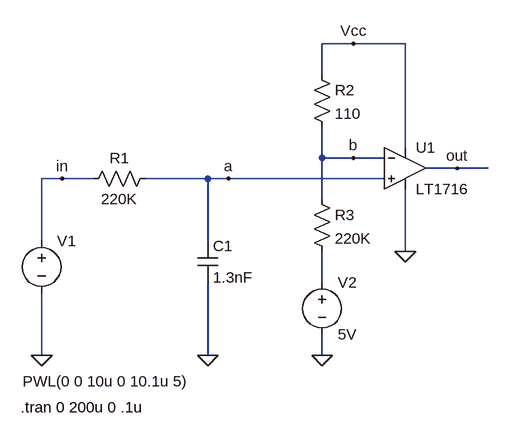
[diagram p0: schematic problem-2.asc]
problem-2.asc, the LTspice schematic file:
Version 4
SHEET 1 1128 680
WIRE 496 -288 448 -288
WIRE 576 -288 496 -288
WIRE 448 -240 448 -288
WIRE 576 -128 576 -288
WIRE 448 -112 448 -160
WIRE 496 -112 448 -112
WIRE 544 -112 496 -112
WIRE 656 -96 608 -96
WIRE 704 -96 656 -96
WIRE 48 -80 16 -80
WIRE 96 -80 48 -80
WIRE 272 -80 176 -80
WIRE 304 -80 272 -80
WIRE 544 -80 304 -80
WIRE 448 -48 448 -112
WIRE 16 16 16 -80
WIRE 272 16 272 -80
WIRE 576 32 576 -64
WIRE 448 80 448 32
WIRE 16 192 16 96
WIRE 272 192 272 80
WIRE 448 192 448 160
FLAG 272 192 0
FLAG 16 192 0
FLAG 576 32 0
FLAG 448 192 0
FLAG 48 -80 in
FLAG 304 -80 a
FLAG 496 -112 b
FLAG 496 -288 Vcc
FLAG 656 -96 out
SYMBOL cap 256 16 R0
SYMATTR InstName C1
SYMATTR Value 1.3nF
SYMBOL voltage 16 0 R0
WINDOW 3 -29 232 Left 2
WINDOW 123 0 0 Left 0
WINDOW 39 0 0 Left 0
SYMATTR Value PWL(0 0 10u 0 10.1u 5)
SYMATTR InstName V1
SYMBOL res 192 -96 R90
WINDOW 0 0 56 VBottom 2
WINDOW 3 32 56 VTop 2
SYMATTR InstName R1
SYMATTR Value 220K
SYMATTR SpiceLine tol=5
SYMBOL res 432 -64 R0
SYMATTR InstName R3
SYMATTR Value 220K
SYMBOL res 432 -256 R0
SYMATTR InstName R2
SYMATTR Value 110
SYMBOL Comparators\\LT1716 576 -96 R0
SYMATTR InstName U1
SYMBOL voltage 448 64 R0
WINDOW 123 0 0 Left 0
WINDOW 39 0 0 Left 0
SYMATTR InstName V2
SYMATTR Value 5V
TEXT -16 272 Left 2 !.tran 0 200u 0 .1u

The netlist it stands for:
* problem-2.asc
C1 a 0 1.3nF
V1 in 0 PWL(0 0 10u 0 10.1u 5)
R1 a in 220K tol=5
R3 b N001 220K
R2 Vcc b 110
XU1 a b Vcc 0 out LT1716  ; pins In+ In- V+ V- OUT
V2 N001 0 5V
.tran 0 200u 0 .1u
.lib LTC1.lib
.backanno
.end